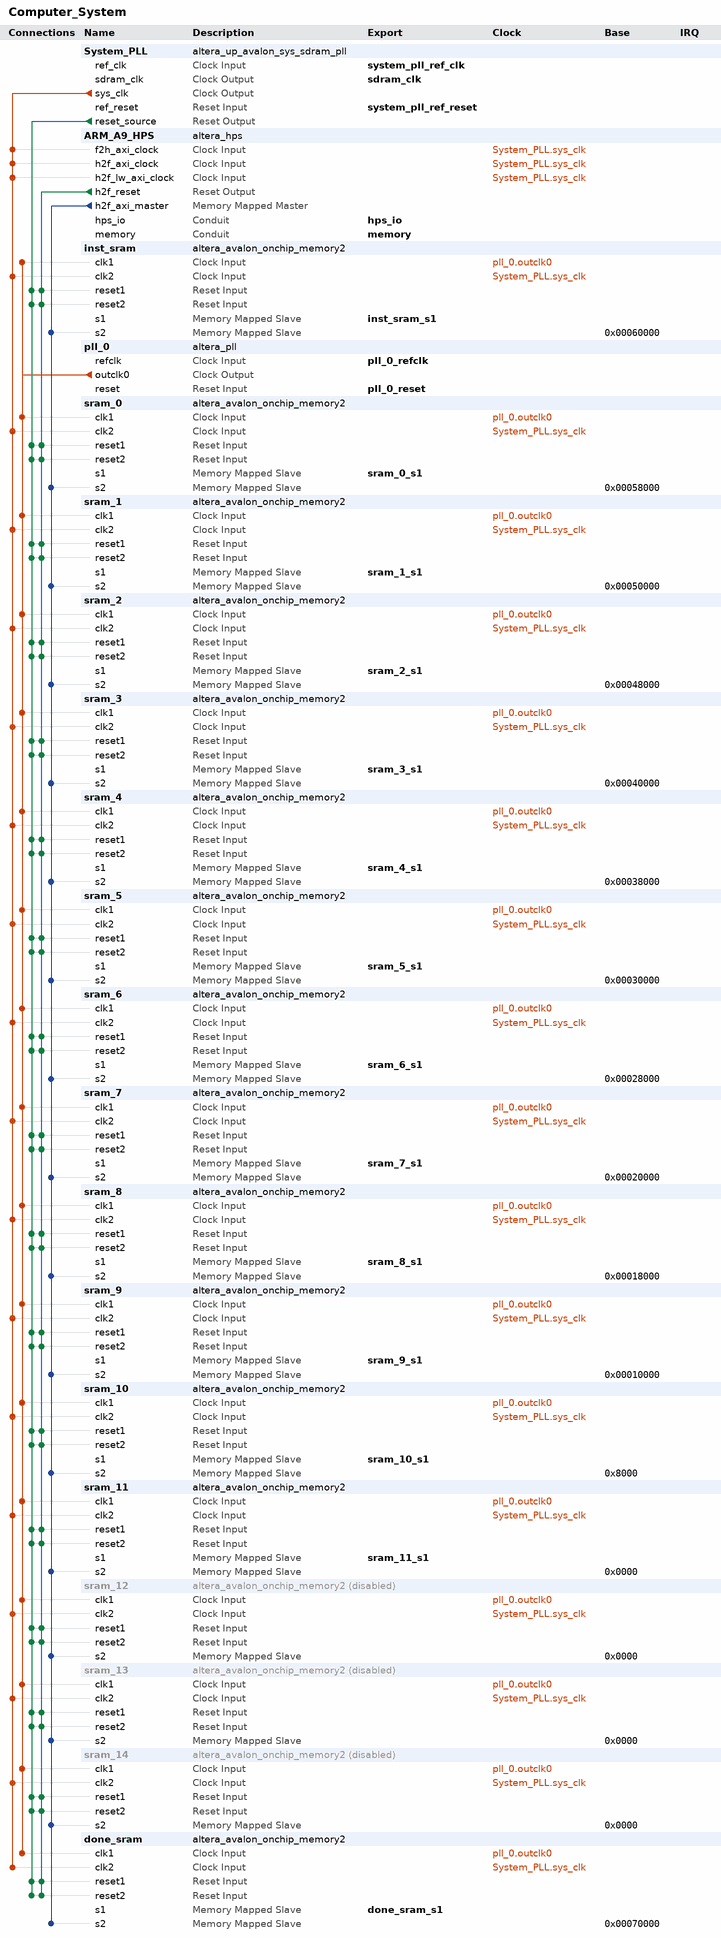
[diagram p0: system contents]
# Platform Designer (Qsys) system Computer_System, Cyclone V 5CSEMA5F31C6
# Parameters at their usual value, and those the tool derives, are not listed.
package require -exact qsys 18.1
create_system Computer_System
set_project_property DEVICE_FAMILY {Cyclone V}
set_project_property DEVICE 5CSEMA5F31C6

add_instance System_PLL altera_up_avalon_sys_sdram_pll 18.0
set_instance_parameter_value System_PLL CV_boards DE1-SoC
set_instance_parameter_value System_PLL gui_outclk 100.0
set_instance_parameter_value System_PLL gui_refclk 50.0

add_instance ARM_A9_HPS altera_hps 18.1
set_instance_parameter_value ARM_A9_HPS EMAC1_Mode RGMII
set_instance_parameter_value ARM_A9_HPS EMAC1_PinMuxing {HPS I/O Set 0}
set_instance_parameter_value ARM_A9_HPS F2SCLK_COLDRST_Enable false
set_instance_parameter_value ARM_A9_HPS F2SCLK_DBGRST_Enable false
set_instance_parameter_value ARM_A9_HPS F2SCLK_WARMRST_Enable false
set_instance_parameter_value ARM_A9_HPS F2SINTERRUPT_Enable true
set_instance_parameter_value ARM_A9_HPS F2S_Width 2
set_instance_parameter_value ARM_A9_HPS FPGA_PERIPHERAL_OUTPUT_CLOCK_FREQ_EMAC0_GTX_CLK 125
set_instance_parameter_value ARM_A9_HPS FPGA_PERIPHERAL_OUTPUT_CLOCK_FREQ_EMAC0_MD_CLK 100.0
set_instance_parameter_value ARM_A9_HPS FPGA_PERIPHERAL_OUTPUT_CLOCK_FREQ_EMAC1_GTX_CLK 125
set_instance_parameter_value ARM_A9_HPS FPGA_PERIPHERAL_OUTPUT_CLOCK_FREQ_EMAC1_MD_CLK 100.0
set_instance_parameter_value ARM_A9_HPS HPS_PROTOCOL DDR3
set_instance_parameter_value ARM_A9_HPS I2C0_Mode I2C
set_instance_parameter_value ARM_A9_HPS I2C0_PinMuxing {HPS I/O Set 0}
set_instance_parameter_value ARM_A9_HPS I2C1_Mode I2C
set_instance_parameter_value ARM_A9_HPS I2C1_PinMuxing {HPS I/O Set 0}
set_instance_parameter_value ARM_A9_HPS LWH2F_Enable true
set_instance_parameter_value ARM_A9_HPS MEM_BANKADDR_WIDTH 3
set_instance_parameter_value ARM_A9_HPS MEM_CLK_FREQ 400.0
set_instance_parameter_value ARM_A9_HPS MEM_COL_ADDR_WIDTH 10
set_instance_parameter_value ARM_A9_HPS MEM_DQ_WIDTH 32
set_instance_parameter_value ARM_A9_HPS MEM_DRV_STR RZQ/7
set_instance_parameter_value ARM_A9_HPS MEM_ROW_ADDR_WIDTH 15
set_instance_parameter_value ARM_A9_HPS MEM_RTT_NOM RZQ/4
set_instance_parameter_value ARM_A9_HPS MEM_RTT_WR RZQ/4
set_instance_parameter_value ARM_A9_HPS MEM_TCL 11
set_instance_parameter_value ARM_A9_HPS MEM_TFAW_NS 30.0
set_instance_parameter_value ARM_A9_HPS MEM_TRAS_NS 35.0
set_instance_parameter_value ARM_A9_HPS MEM_TRCD_NS 13.75
set_instance_parameter_value ARM_A9_HPS MEM_TRFC_NS 260.0
set_instance_parameter_value ARM_A9_HPS MEM_TRP_NS 13.75
set_instance_parameter_value ARM_A9_HPS MEM_VENDOR JEDEC
set_instance_parameter_value ARM_A9_HPS MEM_WTCL 8
set_instance_parameter_value ARM_A9_HPS QSPI_Mode {1 SS}
set_instance_parameter_value ARM_A9_HPS QSPI_PinMuxing {HPS I/O Set 0}
set_instance_parameter_value ARM_A9_HPS REF_CLK_FREQ 25.0
set_instance_parameter_value ARM_A9_HPS S2FCLK_USER2CLK 5
set_instance_parameter_value ARM_A9_HPS S2F_Width 3
set_instance_parameter_value ARM_A9_HPS SDIO_Mode {4-bit Data}
set_instance_parameter_value ARM_A9_HPS SDIO_PinMuxing {HPS I/O Set 0}
set_instance_parameter_value ARM_A9_HPS SPIM1_Mode {Single Slave Select}
set_instance_parameter_value ARM_A9_HPS SPIM1_PinMuxing {HPS I/O Set 0}
set_instance_parameter_value ARM_A9_HPS STM_Enable false
set_instance_parameter_value ARM_A9_HPS TIMING_BOARD_AC_SKEW 0.03
set_instance_parameter_value ARM_A9_HPS TIMING_BOARD_AC_TO_CK_SKEW 0.0
set_instance_parameter_value ARM_A9_HPS TIMING_BOARD_DQ_TO_DQS_SKEW 0.0
set_instance_parameter_value ARM_A9_HPS TIMING_BOARD_MAX_CK_DELAY 0.03
set_instance_parameter_value ARM_A9_HPS TIMING_BOARD_MAX_DQS_DELAY 0.02
set_instance_parameter_value ARM_A9_HPS TIMING_BOARD_SKEW_BETWEEN_DQS 0.08
set_instance_parameter_value ARM_A9_HPS TIMING_BOARD_SKEW_CKDQS_DIMM_MAX 0.16
set_instance_parameter_value ARM_A9_HPS TIMING_BOARD_SKEW_CKDQS_DIMM_MIN 0.09
set_instance_parameter_value ARM_A9_HPS TIMING_BOARD_SKEW_WITHIN_DQS 0.01
set_instance_parameter_value ARM_A9_HPS TIMING_TDH 65
set_instance_parameter_value ARM_A9_HPS TIMING_TDQSCK 255
set_instance_parameter_value ARM_A9_HPS TIMING_TDQSQ 125
set_instance_parameter_value ARM_A9_HPS TIMING_TDS 30
set_instance_parameter_value ARM_A9_HPS TIMING_TIH 140
set_instance_parameter_value ARM_A9_HPS TIMING_TIS 180
set_instance_parameter_value ARM_A9_HPS TIMING_TQSH 0.4
set_instance_parameter_value ARM_A9_HPS UART0_Mode {No Flow Control}
set_instance_parameter_value ARM_A9_HPS UART0_PinMuxing {HPS I/O Set 0}
set_instance_parameter_value ARM_A9_HPS USB1_Mode SDR
set_instance_parameter_value ARM_A9_HPS USB1_PinMuxing {HPS I/O Set 0}
set_instance_parameter_value ARM_A9_HPS desired_cfg_clk_mhz 100.0
set_instance_parameter_value ARM_A9_HPS desired_qspi_clk_mhz 400.0

add_instance inst_sram altera_avalon_onchip_memory2 18.1
set_instance_parameter_value inst_sram dataWidth 128
set_instance_parameter_value inst_sram dualPort true
set_instance_parameter_value inst_sram initMemContent true
set_instance_parameter_value inst_sram initializationFileName onchip_mem.hex
set_instance_parameter_value inst_sram memorySize 8192

add_instance pll_0 altera_pll 18.1
set_instance_parameter_value pll_0 gui_device_speed_grade 1
set_instance_parameter_value pll_0 gui_number_of_clocks 1
set_instance_parameter_value pll_0 gui_operation_mode direct
set_instance_parameter_value pll_0 gui_output_clock_frequency0 250.0
set_instance_parameter_value pll_0 gui_pll_mode {Integer-N PLL}
set_instance_parameter_value pll_0 gui_reference_clock_frequency 50.0
set_instance_parameter_value pll_0 gui_use_locked false

add_instance sram_0 altera_avalon_onchip_memory2 18.1
set_instance_parameter_value sram_0 dataWidth 16
set_instance_parameter_value sram_0 dualPort true
set_instance_parameter_value sram_0 initMemContent true
set_instance_parameter_value sram_0 initializationFileName onchip_mem.hex
set_instance_parameter_value sram_0 memorySize 32768

add_instance sram_1 altera_avalon_onchip_memory2 18.1
set_instance_parameter_value sram_1 dataWidth 16
set_instance_parameter_value sram_1 dualPort true
set_instance_parameter_value sram_1 initMemContent true
set_instance_parameter_value sram_1 initializationFileName onchip_mem.hex
set_instance_parameter_value sram_1 memorySize 32768

add_instance sram_2 altera_avalon_onchip_memory2 18.1
set_instance_parameter_value sram_2 dataWidth 16
set_instance_parameter_value sram_2 dualPort true
set_instance_parameter_value sram_2 initMemContent true
set_instance_parameter_value sram_2 initializationFileName onchip_mem.hex
set_instance_parameter_value sram_2 memorySize 32768

add_instance sram_3 altera_avalon_onchip_memory2 18.1
set_instance_parameter_value sram_3 dataWidth 16
set_instance_parameter_value sram_3 dualPort true
set_instance_parameter_value sram_3 initMemContent true
set_instance_parameter_value sram_3 initializationFileName onchip_mem.hex
set_instance_parameter_value sram_3 memorySize 32768

add_instance sram_4 altera_avalon_onchip_memory2 18.1
set_instance_parameter_value sram_4 dataWidth 16
set_instance_parameter_value sram_4 dualPort true
set_instance_parameter_value sram_4 initMemContent true
set_instance_parameter_value sram_4 initializationFileName onchip_mem.hex
set_instance_parameter_value sram_4 memorySize 32768

add_instance sram_5 altera_avalon_onchip_memory2 18.1
set_instance_parameter_value sram_5 dataWidth 16
set_instance_parameter_value sram_5 dualPort true
set_instance_parameter_value sram_5 initMemContent true
set_instance_parameter_value sram_5 initializationFileName onchip_mem.hex
set_instance_parameter_value sram_5 memorySize 32768

add_instance sram_6 altera_avalon_onchip_memory2 18.1
set_instance_parameter_value sram_6 dataWidth 16
set_instance_parameter_value sram_6 dualPort true
set_instance_parameter_value sram_6 initMemContent true
set_instance_parameter_value sram_6 initializationFileName onchip_mem.hex
set_instance_parameter_value sram_6 memorySize 32768

add_instance sram_7 altera_avalon_onchip_memory2 18.1
set_instance_parameter_value sram_7 dataWidth 16
set_instance_parameter_value sram_7 dualPort true
set_instance_parameter_value sram_7 initMemContent true
set_instance_parameter_value sram_7 initializationFileName onchip_mem.hex
set_instance_parameter_value sram_7 memorySize 32768

add_instance sram_8 altera_avalon_onchip_memory2 18.1
set_instance_parameter_value sram_8 dataWidth 16
set_instance_parameter_value sram_8 dualPort true
set_instance_parameter_value sram_8 initMemContent true
set_instance_parameter_value sram_8 initializationFileName onchip_mem.hex
set_instance_parameter_value sram_8 memorySize 32768

add_instance sram_9 altera_avalon_onchip_memory2 18.1
set_instance_parameter_value sram_9 dataWidth 16
set_instance_parameter_value sram_9 dualPort true
set_instance_parameter_value sram_9 initMemContent true
set_instance_parameter_value sram_9 initializationFileName onchip_mem.hex
set_instance_parameter_value sram_9 memorySize 32768

add_instance sram_10 altera_avalon_onchip_memory2 18.1
set_instance_parameter_value sram_10 dataWidth 16
set_instance_parameter_value sram_10 dualPort true
set_instance_parameter_value sram_10 initMemContent true
set_instance_parameter_value sram_10 initializationFileName onchip_mem.hex
set_instance_parameter_value sram_10 memorySize 32768

add_instance sram_11 altera_avalon_onchip_memory2 18.1
set_instance_parameter_value sram_11 dataWidth 16
set_instance_parameter_value sram_11 dualPort true
set_instance_parameter_value sram_11 initMemContent true
set_instance_parameter_value sram_11 initializationFileName onchip_mem.hex
set_instance_parameter_value sram_11 memorySize 32768

add_instance sram_12 altera_avalon_onchip_memory2 18.1
set_instance_property sram_12 ENABLED false
set_instance_parameter_value sram_12 dataWidth 16
set_instance_parameter_value sram_12 dualPort true
set_instance_parameter_value sram_12 initMemContent true
set_instance_parameter_value sram_12 initializationFileName onchip_mem.hex
set_instance_parameter_value sram_12 memorySize 32768

add_instance sram_13 altera_avalon_onchip_memory2 18.1
set_instance_property sram_13 ENABLED false
set_instance_parameter_value sram_13 dataWidth 16
set_instance_parameter_value sram_13 dualPort true
set_instance_parameter_value sram_13 initMemContent true
set_instance_parameter_value sram_13 initializationFileName onchip_mem.hex
set_instance_parameter_value sram_13 memorySize 32768

add_instance sram_14 altera_avalon_onchip_memory2 18.1
set_instance_property sram_14 ENABLED false
set_instance_parameter_value sram_14 dataWidth 16
set_instance_parameter_value sram_14 dualPort true
set_instance_parameter_value sram_14 initMemContent true
set_instance_parameter_value sram_14 initializationFileName onchip_mem.hex
set_instance_parameter_value sram_14 memorySize 32768

add_instance done_sram altera_avalon_onchip_memory2 18.1
set_instance_parameter_value done_sram dataWidth 8
set_instance_parameter_value done_sram dualPort true
set_instance_parameter_value done_sram initMemContent true
set_instance_parameter_value done_sram initializationFileName onchip_mem.hex
set_instance_parameter_value done_sram memorySize 512

# connections
add_connection pll_0.outclk0 done_sram.clk1 clock
add_connection pll_0.outclk0 inst_sram.clk1 clock
add_connection pll_0.outclk0 sram_0.clk1 clock
add_connection pll_0.outclk0 sram_1.clk1 clock
add_connection pll_0.outclk0 sram_2.clk1 clock
add_connection pll_0.outclk0 sram_3.clk1 clock
add_connection pll_0.outclk0 sram_4.clk1 clock
add_connection pll_0.outclk0 sram_5.clk1 clock
add_connection pll_0.outclk0 sram_6.clk1 clock
add_connection pll_0.outclk0 sram_7.clk1 clock
add_connection pll_0.outclk0 sram_8.clk1 clock
add_connection pll_0.outclk0 sram_9.clk1 clock
add_connection pll_0.outclk0 sram_10.clk1 clock
add_connection pll_0.outclk0 sram_11.clk1 clock
add_connection pll_0.outclk0 sram_12.clk1 clock
add_connection pll_0.outclk0 sram_13.clk1 clock
add_connection pll_0.outclk0 sram_14.clk1 clock
add_connection System_PLL.sys_clk ARM_A9_HPS.f2h_axi_clock clock
add_connection System_PLL.sys_clk ARM_A9_HPS.h2f_axi_clock clock
add_connection System_PLL.sys_clk ARM_A9_HPS.h2f_lw_axi_clock clock
add_connection System_PLL.sys_clk done_sram.clk2 clock
add_connection System_PLL.sys_clk inst_sram.clk2 clock
add_connection System_PLL.sys_clk sram_0.clk2 clock
add_connection System_PLL.sys_clk sram_1.clk2 clock
add_connection System_PLL.sys_clk sram_2.clk2 clock
add_connection System_PLL.sys_clk sram_3.clk2 clock
add_connection System_PLL.sys_clk sram_4.clk2 clock
add_connection System_PLL.sys_clk sram_5.clk2 clock
add_connection System_PLL.sys_clk sram_6.clk2 clock
add_connection System_PLL.sys_clk sram_7.clk2 clock
add_connection System_PLL.sys_clk sram_8.clk2 clock
add_connection System_PLL.sys_clk sram_9.clk2 clock
add_connection System_PLL.sys_clk sram_10.clk2 clock
add_connection System_PLL.sys_clk sram_11.clk2 clock
add_connection System_PLL.sys_clk sram_12.clk2 clock
add_connection System_PLL.sys_clk sram_13.clk2 clock
add_connection System_PLL.sys_clk sram_14.clk2 clock
add_connection ARM_A9_HPS.h2f_reset done_sram.reset1 reset
add_connection ARM_A9_HPS.h2f_reset done_sram.reset2 reset
add_connection ARM_A9_HPS.h2f_reset inst_sram.reset1 reset
add_connection ARM_A9_HPS.h2f_reset inst_sram.reset2 reset
add_connection ARM_A9_HPS.h2f_reset sram_0.reset1 reset
add_connection ARM_A9_HPS.h2f_reset sram_0.reset2 reset
add_connection ARM_A9_HPS.h2f_reset sram_1.reset1 reset
add_connection ARM_A9_HPS.h2f_reset sram_1.reset2 reset
add_connection ARM_A9_HPS.h2f_reset sram_2.reset1 reset
add_connection ARM_A9_HPS.h2f_reset sram_2.reset2 reset
add_connection ARM_A9_HPS.h2f_reset sram_3.reset1 reset
add_connection ARM_A9_HPS.h2f_reset sram_3.reset2 reset
add_connection ARM_A9_HPS.h2f_reset sram_4.reset1 reset
add_connection ARM_A9_HPS.h2f_reset sram_4.reset2 reset
add_connection ARM_A9_HPS.h2f_reset sram_5.reset1 reset
add_connection ARM_A9_HPS.h2f_reset sram_5.reset2 reset
add_connection ARM_A9_HPS.h2f_reset sram_6.reset1 reset
add_connection ARM_A9_HPS.h2f_reset sram_6.reset2 reset
add_connection ARM_A9_HPS.h2f_reset sram_7.reset1 reset
add_connection ARM_A9_HPS.h2f_reset sram_7.reset2 reset
add_connection ARM_A9_HPS.h2f_reset sram_8.reset1 reset
add_connection ARM_A9_HPS.h2f_reset sram_8.reset2 reset
add_connection ARM_A9_HPS.h2f_reset sram_9.reset1 reset
add_connection ARM_A9_HPS.h2f_reset sram_9.reset2 reset
add_connection ARM_A9_HPS.h2f_reset sram_10.reset1 reset
add_connection ARM_A9_HPS.h2f_reset sram_10.reset2 reset
add_connection ARM_A9_HPS.h2f_reset sram_11.reset1 reset
add_connection ARM_A9_HPS.h2f_reset sram_11.reset2 reset
add_connection ARM_A9_HPS.h2f_reset sram_12.reset1 reset
add_connection ARM_A9_HPS.h2f_reset sram_12.reset2 reset
add_connection ARM_A9_HPS.h2f_reset sram_13.reset1 reset
add_connection ARM_A9_HPS.h2f_reset sram_13.reset2 reset
add_connection ARM_A9_HPS.h2f_reset sram_14.reset1 reset
add_connection ARM_A9_HPS.h2f_reset sram_14.reset2 reset
add_connection System_PLL.reset_source done_sram.reset1 reset
add_connection System_PLL.reset_source done_sram.reset2 reset
add_connection System_PLL.reset_source inst_sram.reset1 reset
add_connection System_PLL.reset_source inst_sram.reset2 reset
add_connection System_PLL.reset_source sram_0.reset1 reset
add_connection System_PLL.reset_source sram_0.reset2 reset
add_connection System_PLL.reset_source sram_1.reset1 reset
add_connection System_PLL.reset_source sram_1.reset2 reset
add_connection System_PLL.reset_source sram_2.reset1 reset
add_connection System_PLL.reset_source sram_2.reset2 reset
add_connection System_PLL.reset_source sram_3.reset1 reset
add_connection System_PLL.reset_source sram_3.reset2 reset
add_connection System_PLL.reset_source sram_4.reset1 reset
add_connection System_PLL.reset_source sram_4.reset2 reset
add_connection System_PLL.reset_source sram_5.reset1 reset
add_connection System_PLL.reset_source sram_5.reset2 reset
add_connection System_PLL.reset_source sram_6.reset1 reset
add_connection System_PLL.reset_source sram_6.reset2 reset
add_connection System_PLL.reset_source sram_7.reset1 reset
add_connection System_PLL.reset_source sram_7.reset2 reset
add_connection System_PLL.reset_source sram_8.reset1 reset
add_connection System_PLL.reset_source sram_8.reset2 reset
add_connection System_PLL.reset_source sram_9.reset1 reset
add_connection System_PLL.reset_source sram_9.reset2 reset
add_connection System_PLL.reset_source sram_10.reset1 reset
add_connection System_PLL.reset_source sram_10.reset2 reset
add_connection System_PLL.reset_source sram_11.reset1 reset
add_connection System_PLL.reset_source sram_11.reset2 reset
add_connection System_PLL.reset_source sram_12.reset1 reset
add_connection System_PLL.reset_source sram_12.reset2 reset
add_connection System_PLL.reset_source sram_13.reset1 reset
add_connection System_PLL.reset_source sram_13.reset2 reset
add_connection System_PLL.reset_source sram_14.reset1 reset
add_connection System_PLL.reset_source sram_14.reset2 reset
add_connection ARM_A9_HPS.h2f_axi_master done_sram.s2 avalon
set_connection_parameter_value ARM_A9_HPS.h2f_axi_master/done_sram.s2 baseAddress 0x00070000
add_connection ARM_A9_HPS.h2f_axi_master inst_sram.s2 avalon
set_connection_parameter_value ARM_A9_HPS.h2f_axi_master/inst_sram.s2 baseAddress 0x00060000
add_connection ARM_A9_HPS.h2f_axi_master sram_0.s2 avalon
set_connection_parameter_value ARM_A9_HPS.h2f_axi_master/sram_0.s2 baseAddress 0x00058000
add_connection ARM_A9_HPS.h2f_axi_master sram_1.s2 avalon
set_connection_parameter_value ARM_A9_HPS.h2f_axi_master/sram_1.s2 baseAddress 0x00050000
add_connection ARM_A9_HPS.h2f_axi_master sram_2.s2 avalon
set_connection_parameter_value ARM_A9_HPS.h2f_axi_master/sram_2.s2 baseAddress 0x00048000
add_connection ARM_A9_HPS.h2f_axi_master sram_3.s2 avalon
set_connection_parameter_value ARM_A9_HPS.h2f_axi_master/sram_3.s2 baseAddress 0x00040000
add_connection ARM_A9_HPS.h2f_axi_master sram_4.s2 avalon
set_connection_parameter_value ARM_A9_HPS.h2f_axi_master/sram_4.s2 baseAddress 0x00038000
add_connection ARM_A9_HPS.h2f_axi_master sram_5.s2 avalon
set_connection_parameter_value ARM_A9_HPS.h2f_axi_master/sram_5.s2 baseAddress 0x00030000
add_connection ARM_A9_HPS.h2f_axi_master sram_6.s2 avalon
set_connection_parameter_value ARM_A9_HPS.h2f_axi_master/sram_6.s2 baseAddress 0x00028000
add_connection ARM_A9_HPS.h2f_axi_master sram_7.s2 avalon
set_connection_parameter_value ARM_A9_HPS.h2f_axi_master/sram_7.s2 baseAddress 0x00020000
add_connection ARM_A9_HPS.h2f_axi_master sram_8.s2 avalon
set_connection_parameter_value ARM_A9_HPS.h2f_axi_master/sram_8.s2 baseAddress 0x00018000
add_connection ARM_A9_HPS.h2f_axi_master sram_9.s2 avalon
set_connection_parameter_value ARM_A9_HPS.h2f_axi_master/sram_9.s2 baseAddress 0x00010000
add_connection ARM_A9_HPS.h2f_axi_master sram_10.s2 avalon
set_connection_parameter_value ARM_A9_HPS.h2f_axi_master/sram_10.s2 baseAddress 0x8000
add_connection ARM_A9_HPS.h2f_axi_master sram_11.s2 avalon
set_connection_parameter_value ARM_A9_HPS.h2f_axi_master/sram_11.s2 baseAddress 0x0000
add_connection ARM_A9_HPS.h2f_axi_master sram_12.s2 avalon
set_connection_parameter_value ARM_A9_HPS.h2f_axi_master/sram_12.s2 baseAddress 0x0000
add_connection ARM_A9_HPS.h2f_axi_master sram_13.s2 avalon
set_connection_parameter_value ARM_A9_HPS.h2f_axi_master/sram_13.s2 baseAddress 0x0000
add_connection ARM_A9_HPS.h2f_axi_master sram_14.s2 avalon
set_connection_parameter_value ARM_A9_HPS.h2f_axi_master/sram_14.s2 baseAddress 0x0000

# exported interfaces
add_interface done_sram_s1 avalon slave
set_interface_property done_sram_s1 EXPORT_OF done_sram.s1
add_interface hps_io conduit end
set_interface_property hps_io EXPORT_OF ARM_A9_HPS.hps_io
add_interface inst_sram_s1 avalon slave
set_interface_property inst_sram_s1 EXPORT_OF inst_sram.s1
add_interface memory conduit end
set_interface_property memory EXPORT_OF ARM_A9_HPS.memory
add_interface pll_0_refclk clock sink
set_interface_property pll_0_refclk EXPORT_OF pll_0.refclk
add_interface pll_0_reset reset sink
set_interface_property pll_0_reset EXPORT_OF pll_0.reset
add_interface sdram_clk clock source
set_interface_property sdram_clk EXPORT_OF System_PLL.sdram_clk
add_interface sram_0_s1 avalon slave
set_interface_property sram_0_s1 EXPORT_OF sram_0.s1
add_interface sram_10_s1 avalon slave
set_interface_property sram_10_s1 EXPORT_OF sram_10.s1
add_interface sram_11_s1 avalon slave
set_interface_property sram_11_s1 EXPORT_OF sram_11.s1
add_interface sram_1_s1 avalon slave
set_interface_property sram_1_s1 EXPORT_OF sram_1.s1
add_interface sram_2_s1 avalon slave
set_interface_property sram_2_s1 EXPORT_OF sram_2.s1
add_interface sram_3_s1 avalon slave
set_interface_property sram_3_s1 EXPORT_OF sram_3.s1
add_interface sram_4_s1 avalon slave
set_interface_property sram_4_s1 EXPORT_OF sram_4.s1
add_interface sram_5_s1 avalon slave
set_interface_property sram_5_s1 EXPORT_OF sram_5.s1
add_interface sram_6_s1 avalon slave
set_interface_property sram_6_s1 EXPORT_OF sram_6.s1
add_interface sram_7_s1 avalon slave
set_interface_property sram_7_s1 EXPORT_OF sram_7.s1
add_interface sram_8_s1 avalon slave
set_interface_property sram_8_s1 EXPORT_OF sram_8.s1
add_interface sram_9_s1 avalon slave
set_interface_property sram_9_s1 EXPORT_OF sram_9.s1
add_interface system_pll_ref_clk clock sink
set_interface_property system_pll_ref_clk EXPORT_OF System_PLL.ref_clk
add_interface system_pll_ref_reset reset sink
set_interface_property system_pll_ref_reset EXPORT_OF System_PLL.ref_reset

set_interconnect_requirement {$system} qsys_mm.clockCrossingAdapter HANDSHAKE
set_interconnect_requirement {$system} qsys_mm.enableEccProtection FALSE
set_interconnect_requirement {$system} qsys_mm.insertDefaultSlave FALSE
set_interconnect_requirement {$system} qsys_mm.maxAdditionalLatency 1

save_system Computer_System.qsys
